# Altium project TempController.PrjPcb
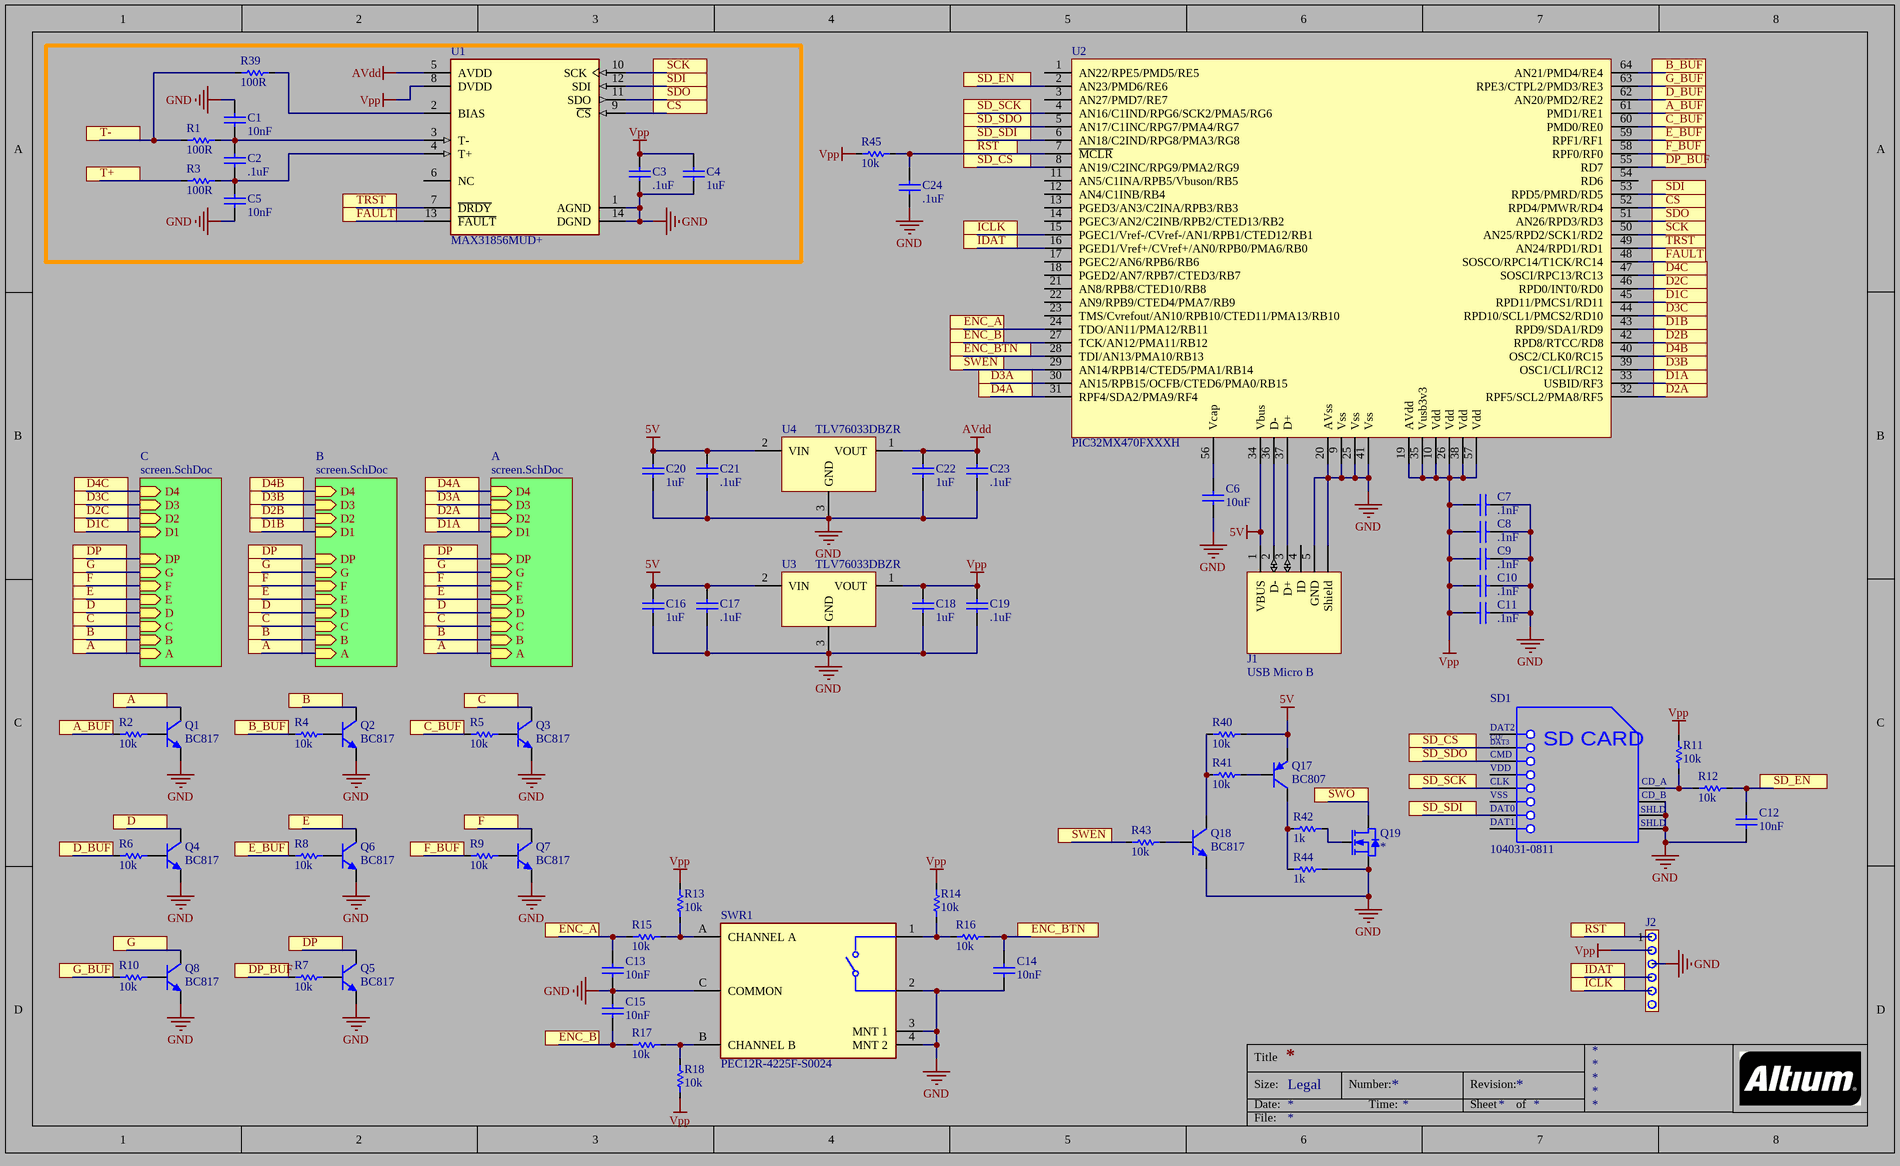
[diagram p0: Sheet1.SchDoc]
2 sheets, 155 parts. Net scope: hierarchical (ports join the sheet entries above them; power ports are global).
Board file: TempController.PcbDoc
Sheets:
  Sheet1.SchDoc
    A = screen.SchDoc
    B = screen.SchDoc
    C = screen.SchDoc

## Sheet Sheet1.SchDoc
size Legal

### Parts
C1  value 10nF  [Size_0603_N]
C2  value .1uF  [Size_0603_N]
C3  value .1uF  [Size_0603_N]
C4  value 1uF  [Size_0805_N]
C5  value 10nF  [Size_0603_N]
C6  value 10uF  [Size_0805_N]
C7  value .1nF  [Size_0603_N]
C8  value .1nF  [Size_0603_N]
C9  value .1nF  [Size_0603_N]
C10  value .1nF  [Size_0603_N]
C11  value .1nF  [Size_0603_N]
C12  value 10nF  [Size_0603_N]
C13  value 10nF  [Size_0603_N]
C14  value 10nF  [Size_0603_N]
C15  value 10nF  [Size_0603_N]
C16  value 1uF  [Size_0805_N]
C17  value .1uF  [Size_0603_N]
C18  value 1uF  [Size_0805_N]
C19  value .1uF  [Size_0603_N]
C20  value 1uF  [Size_0805_N]
C21  value .1uF  [Size_0603_N]
C22  value 1uF  [Size_0805_N]
C23  value .1uF  [Size_0603_N]
C24  value .1uF  [Size_0603_N]
J1  USB Micro B  [USB-MICRO-B (10118194-0001LF)]
J2  (no value)  [HDR1X6 VERT - L]
Q1  BC817  [SOT23-3]
Q2  BC817  [SOT23-3]
Q3  BC817  [SOT23-3]
Q4  BC817  [SOT23-3]
Q5  BC817  [SOT23-3]
Q6  BC817  [SOT23-3]
Q7  BC817  [SOT23-3]
Q8  BC817  [SOT23-3]
Q17  BC807  [SOT23-3]
Q18  BC817  [SOT23-3]
Q19  *  [SOT23-3]
R1  value 100R  [Size_0603_N]  (hidden comment: 100R, *)
R2  value 10k  [Size_0603_N]  (hidden comment: 10k, *)
R3  value 100R  [Size_0603_N]  (hidden comment: 100R, *)
R4  value 10k  [Size_0603_N]  (hidden comment: 10k, *)
R5  value 10k  [Size_0603_N]  (hidden comment: 10k, *)
R6  value 10k  [Size_0603_N]  (hidden comment: 10k, *)
R7  value 10k  [Size_0603_N]  (hidden comment: 10k, *)
R8  value 10k  [Size_0603_N]  (hidden comment: 10k, *)
R9  value 10k  [Size_0603_N]  (hidden comment: 10k, *)
R10  value 10k  [Size_0603_N]  (hidden comment: 10k, *)
R11  value 10k  [Size_0603_N]  (hidden comment: 10k, *)
R12  value 10k  [Size_0603_N]  (hidden comment: 10k, *)
R13  value 10k  [Size_0603_N]  (hidden comment: 10k, *)
R14  value 10k  [Size_0603_N]  (hidden comment: 10k, *)
R15  value 10k  [Size_0603_N]  (hidden comment: 10k, *)
R16  value 10k  [Size_0603_N]  (hidden comment: 10k, *)
R17  value 10k  [Size_0603_N]  (hidden comment: 10k, *)
R18  value 10k  [Size_0603_N]  (hidden comment: 10k, *)
R39  value 100R  [Size_0603_N]  (hidden comment: 100R, *)
R40  value 10k  [Size_0603_N]  (hidden comment: 10k, *)
R41  value 10k  [Size_0603_N]  (hidden comment: 10k, *)
R42  value 1k  [Size_0603_N]  (hidden comment: 1k, *)
R43  value 10k  [Size_0603_N]  (hidden comment: 10k, *)
R44  value 1k  [Size_0603_N]  (hidden comment: 1k, *)
R45  value 10k  [Size_0603_N]  (hidden comment: 10k, *)
SD1  104031-0811  [MOLX-104031-0811_V]
SWR1  PEC12R-4225F-S0024  [PEC12R]
U1  MAX31856MUD+  [FP-U14-2-MFG]
U2  PIC32MX470FXXXH  [TSQFP50P1200X1200X120-64M]
U3  TLV76033DBZR  [SOT23-3]
U4  TLV76033DBZR  [SOT23-3]

### Sub-sheets
A = screen.SchDoc: D4 (in), D3 (in), D2 (in), D1 (in), B (in), G (in), A (in), C (in), F (in), DP (in), E (in), D (in)
B = screen.SchDoc: D4 (in), D3 (in), D2 (in), D1 (in), B (in), G (in), A (in), C (in), F (in), DP (in), E (in), D (in)
C = screen.SchDoc: D4 (in), D3 (in), D2 (in), D1 (in), B (in), G (in), A (in), C (in), F (in), DP (in), E (in), D (in)

### Nets
5V: C16.2 C17.2 C20.2 C21.2 J1.1(VBUS) Q17.2(E) R40.2 U2.34(Vbus) U3.2(VIN) U4.2(VIN)
AVdd: C22.2 C23.2 U1.5(AVDD) U4.1(VOUT)
GND: C1.2 C3.1 C4.1 C5.1 C6.1 C7.2 C8.2 C9.2 C10.2 C11.2 C12.1 C13.1 C14.1 C15.2 C16.1 C17.1 C18.1 C19.1 C20.1 C21.1 C22.1 C23.1 C24.1 J1.5(GND) J1.Shield J2.3 Q1.2(E) Q2.2(E) Q3.2(E) Q4.2(E) Q5.2(E) Q6.2(E) Q7.2(E) Q8.2(E) Q18.2(E) Q19.2(S) R44.2 SD1.10(CD_B) SD1.11(SHLD1) SD1.12(SHLD2) SWR1.2 SWR1.3(MNT_1) SWR1.4(MNT_2) SWR1.C(COMMON) U1.1(AGND) U1.14(DGND) U2.9(Vss) U2.20(AVss) U2.25(Vss) U2.41(Vss) U3.3(GND) U4.3(GND)
Vpp: C3.2 C4.2 C7.1 C8.1 C9.1 C10.1 C11.1 C18.2 C19.2 J2.2 R11.1 R13.1 R14.1 R18.2 R45.1 U1.8(DVDD) U2.10(Vdd) U2.19(AVdd) U2.26(Vdd) U2.35(Vusb3v3) U2.38(Vdd) U2.57(Vdd) U3.1(VOUT)
A: Q1.3(C) ; sheet A/A, sheet B/A, sheet C/A
A_BUF: R2.2 U2.61(PMD1/RE1)
B: Q2.3(C) ; sheet A/B, sheet B/B, sheet C/B
B_BUF: R4.2 U2.64(AN21/PMD4/RE4)
C: Q3.3(C) ; sheet A/C, sheet B/C, sheet C/C
C_BUF: R5.2 U2.60(PMD0/RE0)
CS: U1.9(~{CS}) U2.52(RPD4/PMWR/RD4)
D: Q4.3(C) ; sheet A/D, sheet B/D, sheet C/D
D1A: U2.33(USBID/RF3) ; sheet A/D1  [project net D1]
D1B: U2.43(RPD9/SDA1/RD9) ; sheet B/D1  [project net D1]
D1C: U2.45(RPD11/PMCS1/RD11) ; sheet C/D1  [project net D1]
D2A: U2.32(RPF5/SCL2/PMA8/RF5) ; sheet A/D2  [project net D2]
D2B: U2.42(RPD8/RTCC/RD8) ; sheet B/D2  [project net D2]
D2C: U2.46(RPD0/INT0/RD0) ; sheet C/D2  [project net D2]
D3A: U2.30(AN15/RPB15/OCFB/CTED6/PMA0/RB15) ; sheet A/D3  [project net D3]
D3B: U2.39(OSC1/CLI/RC12) ; sheet B/D3  [project net D3]
D3C: U2.44(RPD10/SCL1/PMCS2/RD10) ; sheet C/D3  [project net D3]
D4A: U2.31(RPF4/SDA2/PMA9/RF4) ; sheet A/D4  [project net D4]
D4B: U2.40(OSC2/CLK0/RC15) ; sheet B/D4  [project net D4]
D4C: U2.47(SOSCI/RPC13/RC13) ; sheet C/D4  [project net D4]
D_BUF: R6.2 U2.62(AN20/PMD2/RE2)
DP: Q5.3(C) ; sheet A/DP, sheet B/DP, sheet C/DP
DP_BUF: R7.2 U2.55(RD7)
E: Q6.3(C) ; sheet A/E, sheet B/E, sheet C/E
E_BUF: R8.2 U2.59(RPF1/RF1)
ENC_A: C13.2 R15.1 U2.24(TDO/AN11/PMA12/RB11)
ENC_B: C15.1 R17.1 U2.27(TCK/AN12/PMA11/RB12)
ENC_BTN: C14.2 R16.2 U2.28(TDI/AN13/PMA10/RB13)
F: Q7.3(C) ; sheet A/F, sheet B/F, sheet C/F
F_BUF: R9.2 U2.58(RPF0/RF0)
FAULT: U1.13(~{FAULT}) U2.48(SOSCO/RPC14/T1CK/RC14)
G: Q8.3(C) ; sheet A/G, sheet B/G, sheet C/G
G_BUF: R10.2 U2.63(RPE3/CTPL2/PMD3/RE3)
ICLK: J2.5 U2.15(PGEC1/Vref-/CVref-/AN1/RPB1/CTED12/RB1)
IDAT: J2.4 U2.16(PGED1/Vref+/CVref+/AN0/RPB0/PMA6/RB0)
RST: C24.2 J2.1 R45.2 U2.7(~{MCLR})
SCK: U1.10(SCK) U2.50(AN25/RPD2/SCK1/RD2)
SD_CS: SD1.2(CMD) U2.8(AN19/C2INC/RPG9/PMA2/RG9)
SD_EN: C12.2 R12.2 U2.2(AN23/PMD6/RE6)
SD_SCK: SD1.5(CLK) U2.4(AN16/C1IND/RPG6/SCK2/PMA5/RG6)
SD_SDI: SD1.7(DAT0) U2.6(AN18/C2IND/RPG8/PMA3/RG8)
SD_SDO: SD1.3(VSS1) U2.5(AN17/C1INC/RPG7/PMA4/RG7)
SDI: U1.12(SDI) U2.53(RPD5/PMRD/RD5)
SDO: U1.11(SDO) U2.51(AN26/RPD3/RD3)
SWEN: R43.1 U2.29(AN14/RPB14/CTED5/PMA1/RB14)
SWO: Q19.3(D)
T+: R3.1
T-: R1.1 R39.1
TRST: U1.7(~{DRDY}) U2.49(AN24/RPD1/RD1)
NetC1_1: C1.1 C2.2 R1.2 U1.3(T-)
NetC2_1: C2.1 C5.2 R3.2 U1.4(T+)
NetC6_2: C6.2 U2.56(Vcap)
NetJ1_2: J1.2(D-) U2.36(D-)
NetJ1_3: J1.3(D+) U2.37(D+)
NetQ1_1: Q1.1(B) R2.1
NetQ2_1: Q2.1(B) R4.1
NetQ3_1: Q3.1(B) R5.1
NetQ4_1: Q4.1(B) R6.1
NetQ5_1: Q5.1(B) R7.1
NetQ6_1: Q6.1(B) R8.1
NetQ7_1: Q7.1(B) R9.1
NetQ8_1: Q8.1(B) R10.1
NetQ17_1: Q17.1(B) R41.2
NetQ17_3: Q17.3(C) R42.1 R44.1
NetQ18_1: Q18.1(B) R43.2
NetQ18_3: Q18.3(C) R40.1 R41.1
NetQ19_1: Q19.1(G) R42.2
NetR11_2: R11.2 R12.1 SD1.9(CD_A)
NetR13_2: R13.2 R15.2 SWR1.A(CHANNEL_A)
NetR14_2: R14.2 R16.1 SWR1.1
NetR17_2: R17.2 R18.1 SWR1.B(CHANNEL_B)
NetR39_2: R39.2 U1.2(BIAS)

Not connected (* = marked no-connect by the designer): J1 4(ID); J2 6; SD1 1(CD/DAT3) 4(VDD) 6(VSS2) 8(DAT1); U1 6(NC); U2 1(AN22/RPE5/PMD5/RE5) 3(AN27/PMD7/RE7) 11(AN5/C1INA/RPB5/Vbuson/RB5) 12(AN4/C1INB/RB4) 13(PGED3/AN3/C2INA/RPB3/RB3) 14(PGEC3/AN2/C2INB/RPB2/CTED13/RB2) 17(PGEC2/AN6/RPB6/RB6) 18(PGED2/AN7/RPB7/CTED3/RB7) 21(AN8/RPB8/CTED10/RB8) 22(AN9/RPB9/CTED4/PMA7/RB9) 23(TMS/Cvrefout/AN10/RPB10/CTED11/PMA13/RB10) 54(RD6)

### Notes on the sheet
- Title
- Size:
- Date:
- Legal
- Number:
- Time:
- Revision:
- Sheet
- of
- File:
- (in symbol CMP-2000-05825-1) DAT2; CD/; DAT3; SD CARD; VSS; SHLD

### Library data of the parts
C1-C24 = -Cap Non-Pol: =Value; Voltage: *; Dielectric: *; Tol: *
J1 = USB Micro B: Female Micro USB Type B
J2 = Header 1-6
Q1-Q8 Q18 = 1-BJT_NPN: NPN General Purpose
Q17 = 1-BJT-PNP
Q19 = 1-Mosfet_N: N-Channel Mosfet; Value: *
R1 R3 R39 = -Res: =Value; Tolerance: 1%; Power: *
R2 R4-R18 R40-R45 = -Res: =Value; Tolerance: .1%; Power: *
SD1 = CMP-2000-05825-1: Micro SD Card, RA, -25 to 85 degC, 8-Pin SMD, RoHS, Tape and Reel; Voltage Rating: 10VAC/DC; Number of Contacts: 8; Insertion - Extraction Style: Push-Pull; Pitch: 1.1mm; Mating Cycles: 10000; Brand: Molex; Current Rating: 500mA; Manufacturer URL: http://www.molex.com/; Card Type: microSD; Mounting Type: Standard; Height: 1.42mm; Mounting Technology: SurfaceMount; Contact Plating: Gold; Product Category: MemoryCardConnectors; Package Description: 8-Pin Surface Mount Device, Body 11.95 x 11.4 mm, Pitch 1.1 mm; Datasheet URL: http://www.molex.com/pdm_docs/sd/1040310811_sd.pdf; Termination Style: SMD; Length: 11.4mm; Housing Material: LiquidCrystalPolymer(LCP); Orientation: RightAngle; RoHS: True; Contact Material: PhosphorBronze; Datasheet Version: Rev. E, 04/2006; Packaging: Reel; Manufacturer: Molex; Series: 104031; Product: CardConnectors; Number of Rows: 1Row; Package Reference: 104031-0811
U1 = CMP-05752-000010-1: IC CONV THERMOCOUPLE 14TSSOP; Operating Supply Current: 1.2mA; Min Supply Voltage: 3V; Max Supply Voltage: 3.6V; Output Type: Digital; Interface: SPI; Min Operating Temperature: -55°C; Max Operating Temperature: 125°C; Case/Package: TSSOP; Mount: Surface Mount; Packaging: Rail/Tube; Number of Pins: 14
U2 = MCU_PIC32MX470FXXXH
U3 U4 = 1-linreg_3 O1I2G3

## Sheet screen.SchDoc
size Legal
Used 3 times, as channels A, B, C. Parts and nets are listed once, with the designators drawn on the sheet.
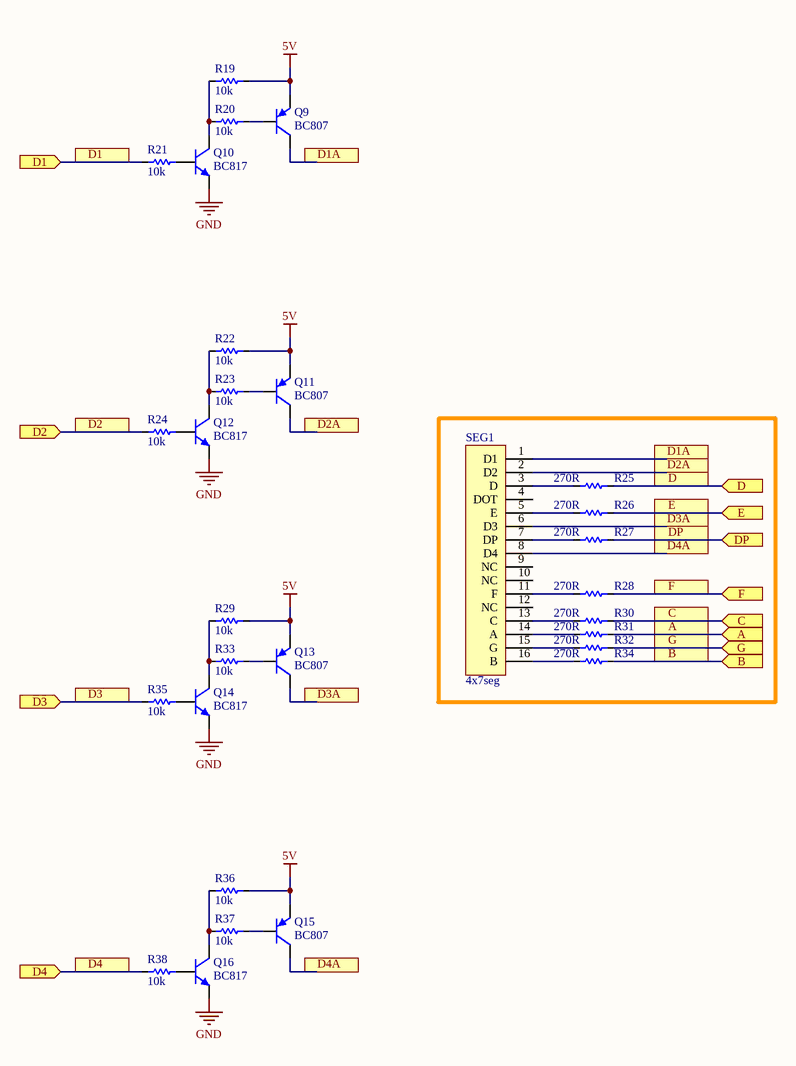
[diagram p1: screen.SchDoc]

### Parts
Q9  BC807  [SOT23-3]
Q10  BC817  [SOT23-3]
Q11  BC807  [SOT23-3]
Q12  BC817  [SOT23-3]
Q13  BC807  [SOT23-3]
Q14  BC817  [SOT23-3]
Q15  BC807  [SOT23-3]
Q16  BC817  [SOT23-3]
R19  value 10k  [Size_0603_N]  (hidden comment: 10k, *)
R20  value 10k  [Size_0603_N]  (hidden comment: 10k, *)
R21  value 10k  [Size_0603_N]  (hidden comment: 10k, *)
R22  value 10k  [Size_0603_N]  (hidden comment: 10k, *)
R23  value 10k  [Size_0603_N]  (hidden comment: 10k, *)
R24  value 10k  [Size_0603_N]  (hidden comment: 10k, *)
R25  value 270R  [Size_0603_N]  (hidden comment: 270R, *)
R26  value 270R  [Size_0603_N]  (hidden comment: 270R, *)
R27  value 270R  [Size_0603_N]  (hidden comment: 270R, *)
R28  value 270R  [Size_0603_N]  (hidden comment: 270R, *)
R29  value 10k  [Size_0603_N]  (hidden comment: 10k, *)
R30  value 270R  [Size_0603_N]  (hidden comment: 270R, *)
R31  value 270R  [Size_0603_N]  (hidden comment: 270R, *)
R32  value 270R  [Size_0603_N]  (hidden comment: 270R, *)
R33  value 10k  [Size_0603_N]  (hidden comment: 10k, *)
R34  value 270R  [Size_0603_N]  (hidden comment: 270R, *)
R35  value 10k  [Size_0603_N]  (hidden comment: 10k, *)
R36  value 10k  [Size_0603_N]  (hidden comment: 10k, *)
R37  value 10k  [Size_0603_N]  (hidden comment: 10k, *)
R38  value 10k  [Size_0603_N]  (hidden comment: 10k, *)
SEG1  4x7seg  [LTC-4627JR]

### Ports
A (in), B (in), C (in), D1 (in), D2 (in), D3 (in), D4 (in), D (in), DP (in), E (in), F (in), G (in)

### Nets
5V: Q9.2(E) Q11.2(E) Q13.2(E) Q15.2(E) R19.1 R22.1 R29.1 R36.1
GND: Q10.2(E) Q12.2(E) Q14.2(E) Q16.2(E)
A: R31.2 ; port A
B: R34.2 ; port B
C: R30.2 ; port C
D: R25.2 ; port D
D1: R21.2 ; port D1
D1A: Q9.3(C) SEG1.1(D1)
D2: R24.2 ; port D2
D2A: Q11.3(C) SEG1.2(D2)
D3: R35.2 ; port D3
D3A: Q13.3(C) SEG1.6(D3)
D4: R38.2 ; port D4
D4A: Q15.3(C) SEG1.8(D4)
DP: R27.2 ; port DP
E: R26.2 ; port E
F: R28.2 ; port F
G: R32.2 ; port G
NetQ9_1: Q9.1(B) R20.1
NetQ10_1: Q10.1(B) R21.1
NetQ10_3: Q10.3(C) R19.2 R20.2
NetQ11_1: Q11.1(B) R23.1
NetQ12_1: Q12.1(B) R24.1
NetQ12_3: Q12.3(C) R22.2 R23.2
NetQ13_1: Q13.1(B) R33.1
NetQ14_1: Q14.1(B) R35.1
NetQ14_3: Q14.3(C) R29.2 R33.2
NetQ15_1: Q15.1(B) R37.1
NetQ16_1: Q16.1(B) R38.1
NetQ16_3: Q16.3(C) R36.2 R37.2
NetR25_1: R25.1 SEG1.3(D)
NetR26_1: R26.1 SEG1.5(E)
NetR27_1: R27.1 SEG1.7(DP)
NetR28_1: R28.1 SEG1.11(F)
NetR30_1: R30.1 SEG1.13(C)
NetR31_1: R31.1 SEG1.14(A)
NetR32_1: R32.1 SEG1.15(G)
NetR34_1: R34.1 SEG1.16(B)

Not connected (* = marked no-connect by the designer): SEG1 4(DOT) 9(NC) 10(NC) 12(NC)

### Channels
A: designators end in A; ports A=A B=B C=C D1=D1 D2=D2 D3=D3 D4=D4 D=D DP=DP E=E F=F G=G
B: designators end in B; ports A=A B=B C=C D1=D1 D2=D2 D3=D3 D4=D4 D=D DP=DP E=E F=F G=G
C: designators end in C; ports A=A B=B C=C D1=D1 D2=D2 D3=D3 D4=D4 D=D DP=DP E=E F=F G=G

### Notes on the sheet
- Title
- Size:
- Date:
- Legal
- Number:
- Time:
- Revision:
- Sheet
- of
- File:

### Library data of the parts
Q9 Q11 Q13 Q15 = 1-BJT-PNP
Q10 Q12 Q14 Q16 = 1-BJT_NPN: NPN General Purpose
R19-R24 R29 R33 R35-R38 = -Res: =Value; Tolerance: .1%; Power: *
R25-R28 R30-R32 R34 = -Res: =Value; Tolerance: 1%; Power: *

## Nets that join several sheets
5V: Sheet1 (10 pins), A (8 pins), B (8 pins), C (8 pins)
GND: Sheet1 (52 pins), A (Q10A.2 Q12A.2 Q14A.2 Q16A.2), B (Q10B.2 Q12B.2 Q14B.2 Q16B.2), C (Q10C.2 Q12C.2 Q14C.2 Q16C.2)
A: Sheet1 (Q1.3), A (R31A.2), B (R31B.2), C (R31C.2)
B: Sheet1 (Q2.3), A (R34A.2), B (R34B.2), C (R34C.2)
C: Sheet1 (Q3.3), A (R30A.2), B (R30B.2), C (R30C.2)
D: Sheet1 (Q4.3), A (R25A.2), B (R25B.2), C (R25C.2)
D1: Sheet1 (U2.33), A (R21A.2)
D1: Sheet1 (U2.43), B (R21B.2)
D1: Sheet1 (U2.45), C (R21C.2)
D2: Sheet1 (U2.32), A (R24A.2)
D2: Sheet1 (U2.42), B (R24B.2)
D2: Sheet1 (U2.46), C (R24C.2)
D3: Sheet1 (U2.30), A (R35A.2)
D3: Sheet1 (U2.39), B (R35B.2)
D3: Sheet1 (U2.44), C (R35C.2)
D4: Sheet1 (U2.31), A (R38A.2)
D4: Sheet1 (U2.40), B (R38B.2)
D4: Sheet1 (U2.47), C (R38C.2)
DP: Sheet1 (Q5.3), A (R27A.2), B (R27B.2), C (R27C.2)
E: Sheet1 (Q6.3), A (R26A.2), B (R26B.2), C (R26C.2)
F: Sheet1 (Q7.3), A (R28A.2), B (R28B.2), C (R28C.2)
G: Sheet1 (Q8.3), A (R32A.2), B (R32B.2), C (R32C.2)